# Altium project MP1584 BUCK CONVERTER.PrjPcb
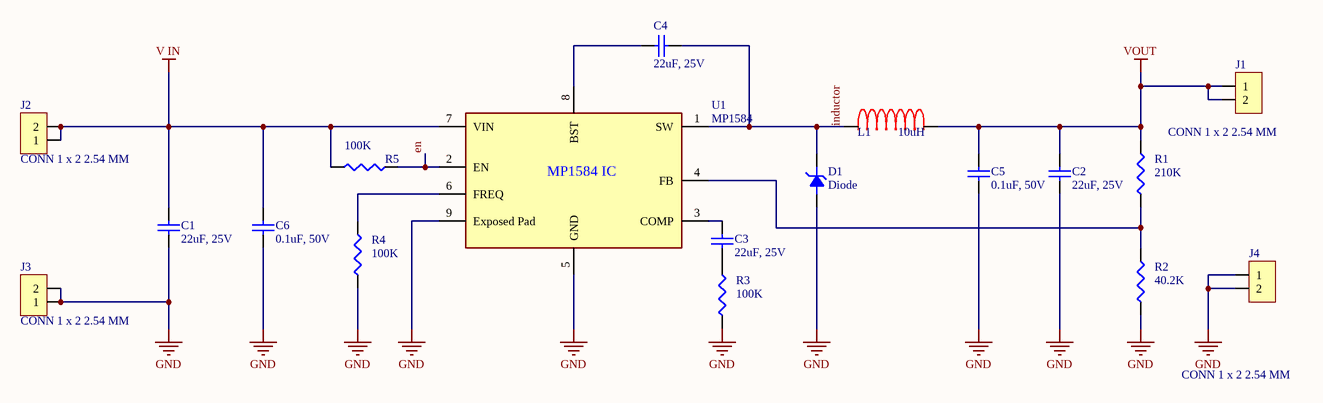
[diagram p0: Sheet1.SchDoc]
1 sheet, 18 parts. Net scope: global (net labels, ports and power ports of the same name join across sheets).
Board file: PCB1.PcbDoc

## Sheet Sheet1.SchDoc
size A4; SheetNumber: 1; SheetTotal: 1

### Parts
C1  22uF, 25V  [CAP_CC1206_3P2X1P6_YAG]
C2  22uF, 25V  [CAP_CC1206_3P2X1P6_YAG]
C3  22uF, 25V  [CAP_CC1206_3P2X1P6_YAG]
C4  22uF, 25V  [CAP_CC1206_3P2X1P6_YAG]
C5  0.1uF, 50V  [CAP_CC1206_3P2X1P6_YAG]
C6  0.1uF, 50V  [CAP_CC1206_3P2X1P6_YAG]
D1  Diode  [DIOM4226X229N]
J1  CONN 1 x 2 2.54 MM  [HDR_1X2_2.54MM]
J2  CONN 1 x 2 2.54 MM  [HDR_1X2_2.54MM]
J3  CONN 1 x 2 2.54 MM  [HDR_1X2_2.54MM]
J4  CONN 1 x 2 2.54 MM  [HDR_1X2_2.54MM]
L1  10uH  [FP-SRP7050TA-MFG]
R1  210K  [FP-CRCW1206-e3-IPC_A]
R2  40.2K  [FP-CRCW1206-e3-IPC_A]
R3  100K  [FP-CRCW1206-e3-IPC_A]
R4  100K  [FP-CRCW1206-e3-IPC_A]
R5  100K  [FP-CRCW1206-e3-IPC_A]
U1  MP1584  [FP-MP1584EN-LF-Z-IPC_A]

### Nets
GND: C1.2 C2.1 C5.1 C6.1 D1.1 J3.1 J3.2 J4.1 J4.2 R2.1 R3.1 R4.1 U1.5(GND) U1.9(Exposed_Pad)
V IN: C1.1 C6.2 J2.1 J2.2 R5.2 U1.7(VIN)
VOUT: C2.2 C5.2 J1.1 J1.2 L1.?2 R1.2
en: R5.1 U1.2(EN)
inductor: C4.1 D1.2 L1.?1 U1.1(SW)
NetC3_1: C3.1 R3.2
NetC3_2: C3.2 U1.3(COMP)
NetC4_2: C4.2 U1.8(BST)
NetR1_1: R1.1 R2.2 U1.4(FB)
NetR4_2: R4.2 U1.6(FREQ)

### Notes on the sheet
- (in symbol MP1584) MP1584 IC

### Library data of the parts
C1-C6 = CC1206KKX5R8BB226: CAP CER 22UF 25V X5R 1206; Manufacturer: Yageo Group; Value: 22µF; Dielectric Material: Ceramic; Tolerance: 10%; Supplier: DigiKey; Supplier Part Number: 13-CC1206KKX5R8BB226DKR-ND; Manufacturer Part Number: CC1206KKX5R8BB226; RoHS: Compliant; Category: Ceramic Capacitors; Pricing: 1=0.65, 10=0.406, 50=0.3078, 100=0.2777, 500=0.22678, 1000=0.21106 (USD); Case/Package: 1206; Case Code (Imperial): 1206; Case Code (Metric): 3216; China RoHS: Compliant; Composition: Ceramic; Country of Origin: Mainland China, Taiwan; Dielectric: X5R; Export Control Classification Number (ECCN) Code: EAR99; Halogen Free: Halogen Free; Height: 1.6mm; Harmonized Tariff Schedule (HTS) Code: 8532.24.00.20; Introduction Date: 2014-07-08; Lead Free: Lead Free; Length: 3.2mm; Lifecycle Status: Production; Max Operating Temperature: 85°C; Min Operating Temperature: -55°C; Mounting Technology: Surface Mount; Number of Terminals: 2; Packaging: Tape & Reel (TR); REACH SVHC: Yes; Schedule B: 8532240020, 8532240020|8532240020|8532240020|8532240020|8532240020; Termination: SMD/SMT; Thickness: 1.4478mm; Voltage Rating: 25V; Voltage Rating (DC): 25V; Weight: 16.187578mg; Width: 1.6mm; ComponentLink1URL: https://datasheet.octopart.com:443/CC1206KKX5R8BB226-Yageo-datasheet-170350636.pdf?src-supplier=IHS; ComponentLink1Description: https://datasheet.octopart.com:443/CC1206KKX5R8BB226-Yageo-datasheet-170350636.pdf?src-supplier=IHS; ComponentLink2URL: https://datasheet.octopart.com:443/CC1206KKX5R8BB226-Yageo-Group-datasheet-189192896.pdf?src-supplier=TME; ComponentLink2Description: https://datasheet.octopart.com:443/CC1206KKX5R8BB226-Yageo-Group-datasheet-189192896.pdf?src-supplier=TME; ComponentLink3URL: https://datasheet.octopart.com:443/CC1206KKX5R8BB226-Yageo-datasheet-181970653.pdf?src-supplier=Farnell; ComponentLink3Description: https://datasheet.octopart.com:443/CC1206KKX5R8BB226-Yageo-datasheet-181970653.pdf?src-supplier=Farnell; ComponentLink4URL: https://datasheet.octopart.com:443/CC1206KKX5R8BB226-Yageo-datasheet-181970650.pdf?src-supplier=Farnell; ComponentLink4Description: https://datasheet.octopart.com:443/CC1206KKX5R8BB226-Yageo-datasheet-181970650.pdf?src-supplier=Farnell; ComponentLink5URL: https://datasheet.octopart.com:443/CC1206KKX5R8BB226-Yageo-datasheet-158238148.pdf?src-supplier=Newark; ComponentLink5Description: https://datasheet.octopart.com:443/CC1206KKX5R8BB226-Yageo-datasheet-158238148.pdf?src-supplier=Newark; ComponentLink6URL: https://datasheet.octopart.com:443/CC1206KKX5R8BB226-Yageo-Group-datasheet-145016144.pdf?src-supplier=ODG+(Origin+Data+Global); ComponentLink6Description: https://datasheet.octopart.com:443/CC1206KKX5R8BB226-Yageo-Group-datasheet-145016144.pdf?src-supplier=ODG+(Origin+Data+Global); ComponentLink7URL: https://datasheet.octopart.com:443/CC1206KKX5R8BB226-Yageo-datasheet-137700085.pdf?src-supplier=Future+Electronics; ComponentLink7Description: https://datasheet.octopart.com:443/CC1206KKX5R8BB226-Yageo-datasheet-137700085.pdf?src-supplier=Future+Electronics; ComponentLink8URL: https://datasheet.octopart.com:443/CC1206KKX5R8BB226-Yageo-datasheet-78855687.pdf?src-supplier=Future+Electronics; ComponentLink8Description: https://datasheet.octopart.com:443/CC1206KKX5R8BB226-Yageo-datasheet-78855687.pdf?src-supplier=Future+Electronics; ComponentLink9URL: https://datasheet.octopart.com:443/CC1206KKX5R8BB226-Yageo-datasheet-62067349.pdf?src-supplier=Future+Electronics; ComponentLink9Description: https://datasheet.octopart.com:443/CC1206KKX5R8BB226-Yageo-datasheet-62067349.pdf?src-supplier=Future+Electronics; ComponentLink10URL: https://datasheet.octopart.com:443/CC1206KKX5R8BB226-Yageo-datasheet-68071816.pdf?src-supplier=Future+Electronics; ComponentLink10Description: https://datasheet.octopart.com:443/CC1206KKX5R8BB226-Yageo-datasheet-68071816.pdf?src-supplier=Future+Electronics; ComponentLink11URL: https://datasheet.octopart.com:443/CC1206KKX5R8BB226-Yageo-datasheet-68297942.pdf?src-supplier=Future+Electronics; ComponentLink11Description: https://datasheet.octopart.com:443/CC1206KKX5R8BB226-Yageo-datasheet-68297942.pdf?src-supplier=Future+Electronics; ComponentLink12URL: https://datasheet.octopart.com:443/CC1206KKX5R8BB226-Yageo-Group-datasheet-192360830.pdf?src-supplier=Future+Electronics; ComponentLink12Description: https://datasheet.octopart.com:443/CC1206KKX5R8BB226-Yageo-Group-datasheet-192360830.pdf?src-supplier=Future+Electronics; ComponentLink13URL: https://datasheet.octopart.com/CC1206KKX5R8BB226-Yageo-datasheet-86397281.pdf; ComponentLink13Description: https://datasheet.octopart.com/CC1206KKX5R8BB226-Yageo-datasheet-86397281.pdf; ComponentLink14URL: http://sigma.octopart.com:80/conflict_mineral_statement/Yageo-company-3.pdf?src-supplier=Compliance+Statements; ComponentLink14Description: http://sigma.octopart.com:80/conflict_mineral_statement/Yageo-company-3.pdf?src-supplier=Compliance+Statements; ComponentLink15URL: http://sigma.octopart.com:80/rohs_statement/Yageo-company-2.pdf?src-supplier=Compliance+Statements; ComponentLink15Description: http://sigma.octopart.com:80/rohs_statement/Yageo-company-2.pdf?src-supplier=Compliance+Statements
D1 = SS34-HF: Diode Schottky 40v 3A SMD DO-214AC(SMA)
J1-J4 = CONN 2 X 2.54
L1 = SRP7050TA-100M: Inductor Power Shielded Wirewound 10uH 20% 100KHz 15Q-Factor Carbonyl Powder 4A 0.069Ohm DCR Automotive T/R; Manufacturer: Bourns; DC Resistance (DCR): 69mΩ; Value: 10µH; Number of Circuits: 1; Q Factor: 15; Saturation Current: 7.5A; Self Resonant Frequency: 15MHz; Supplier: Arrow Electronics; Supplier Part Number: SRP7050TA-100M; Manufacturer Part Number: SRP7050TA-100M; RoHS: Compliant; Category: Fixed Inductors; Stock: 3200; Pricing: 800=0.5393 (USD); Case/Package: Nonstandard; China RoHS: Compliant; Composition: Wirewound; Core Material: Carbonyl Powder; Current Rating: 4A; Export Control Classification Number (ECCN) Code: EAR99; Height: 4.8mm; Height - Seated (Max): 5.0038mm; Harmonized Tariff Schedule (HTS) Code: 8504.50.80.00; Inductance Tolerance: 20%; Introduction Date: 2015-08-06; Length: 7.3mm; Lifecycle Status: Production; Max Current Rating: 4A; Max Operating Temperature: 150°C; Min Operating Temperature: -55°C; Mounting Technology: Surface Mount; Number of Terminals: 2; Ratings: AEC-Q200; REACH SVHC: Yes; RMS Current (Irms): 4A; Schedule B: 8504500000, 8504500000|8504500000, 8504500000|8504500000|8504500000, 8504500000|8504500000|8504500000|8504500000; Shielding: Shielded; Test Frequency: 100kHz; Tolerance: 20%; Width: 6.6mm; ComponentLink1URL: https://datasheet.octopart.com:443/SRP7050TA-100M-Bourns-datasheet-156155934.pdf?src-supplier=IHS; ComponentLink1Description: https://datasheet.octopart.com:443/SRP7050TA-100M-Bourns-datasheet-156155934.pdf?src-supplier=IHS; ComponentLink2URL: https://datasheet.octopart.com:443/SRP7050TA-100M-Bourns-datasheet-68307002.pdf?src-supplier=Master+Electronics; ComponentLink2Description: https://datasheet.octopart.com:443/SRP7050TA-100M-Bourns-datasheet-68307002.pdf?src-supplier=Master+Electronics; ComponentLink3URL: https://datasheet.octopart.com:443/SRP7050TA-100M-Bourns-datasheet-99355716.pdf?src-supplier=Farnell; ComponentLink3Description: https://datasheet.octopart.com:443/SRP7050TA-100M-Bourns-datasheet-99355716.pdf?src-supplier=Farnell; ComponentLink4URL: https://datasheet.octopart.com:443/SRP7050TA-100M-Bourns-datasheet-46733423.pdf?src-supplier=element14+APAC; ComponentLink4Description: https://datasheet.octopart.com:443/SRP7050TA-100M-Bourns-datasheet-46733423.pdf?src-supplier=element14+APAC; ComponentLink5URL: http://sigma.octopart.com:80/conflict_mineral_statement/Bourns-company-36.pdf?src-supplier=Compliance+Statements; ComponentLink5Description: http://sigma.octopart.com:80/conflict_mineral_statement/Bourns-company-36.pdf?src-supplier=Compliance+Statements
R1-R5 = Resistor_1206
U1 = MP1584: Buck Switching Regulator IC Positive Adjustable 0.8V 1 Output 3A 8-SOIC (0.154", 3.90mm Width) Exposed Pad